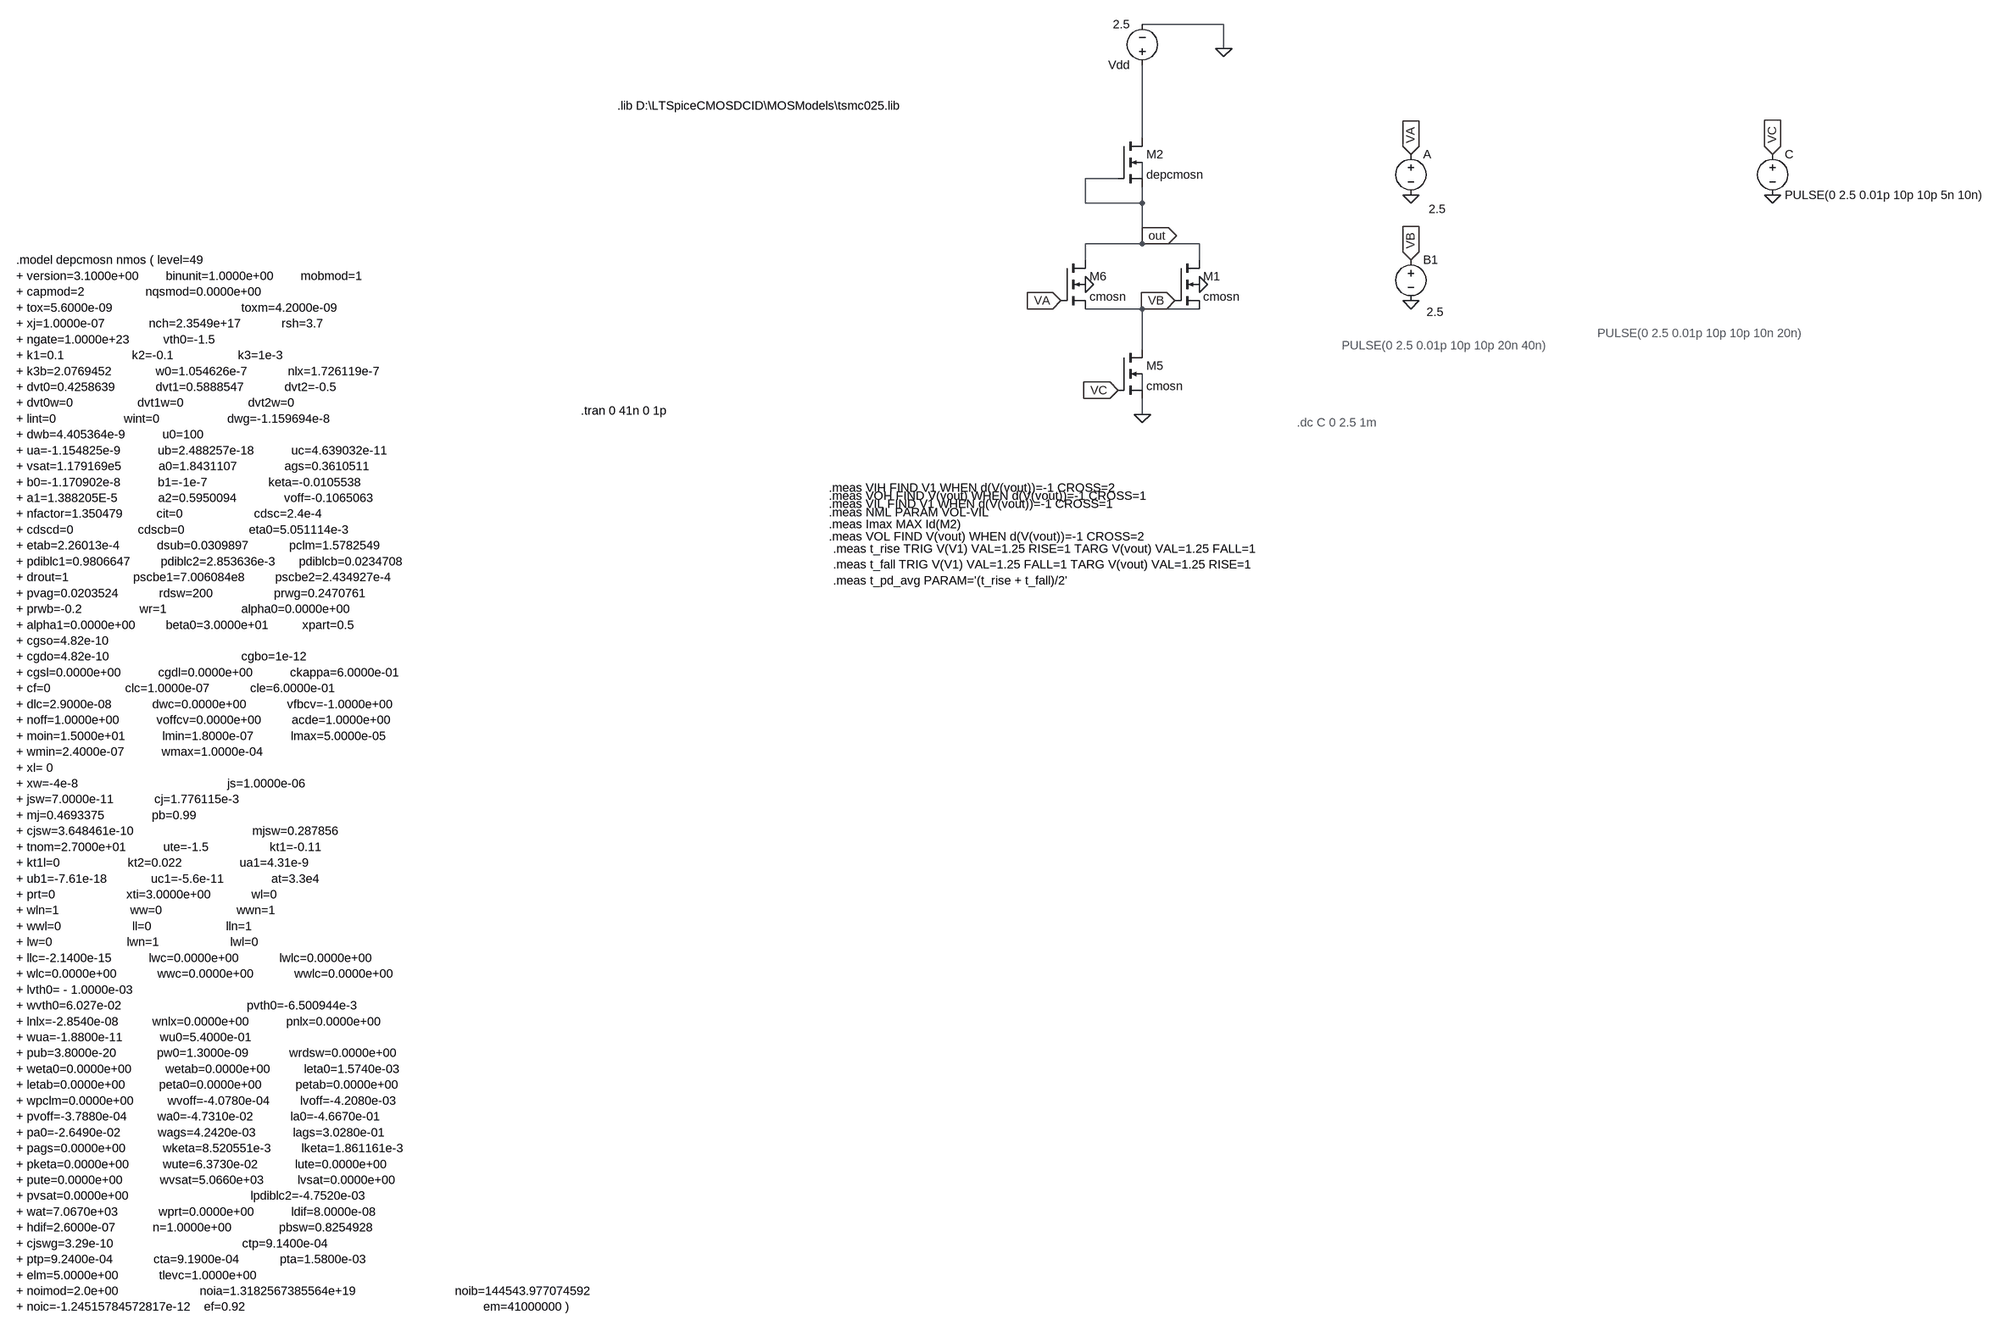
[diagram p0: schematic dep.asc]
dep.asc, the LTspice schematic file:
Version 4
SHEET 1 2744 1816
WIRE 1184 -512 1024 -512
WIRE 1184 -464 1184 -512
WIRE 1024 -288 1024 -432
WIRE 976 -208 912 -208
WIRE 1024 -208 1024 -240
WIRE 912 -160 912 -208
WIRE 1024 -160 1024 -192
WIRE 1024 -160 912 -160
WIRE 1024 -96 1024 -160
WIRE 1024 -80 1024 -96
WIRE 1024 -80 912 -80
WIRE 1136 -80 1024 -80
WIRE 912 -48 912 -80
WIRE 1136 -48 1136 -80
WIRE 1024 48 912 48
WIRE 1136 48 1024 48
WIRE 1024 128 1024 48
WIRE 1024 208 1024 176
WIRE 1024 256 1024 224
FLAG 1024 256 0
FLAG 1184 -464 0
FLAG 912 0 0
FLAG 1136 0 0
FLAG 1552 -256 VA
IOPIN 1552 -256 In
FLAG 2288 -256 VC
IOPIN 2288 -256 In
FLAG 1552 -176 0
FLAG 2288 -176 0
FLAG 864 32 VA
IOPIN 864 32 In
FLAG 1088 32 VB
IOPIN 1088 32 In
FLAG 976 208 VC
IOPIN 976 208 In
FLAG 1024 -96 out
IOPIN 1024 -96 Out
FLAG 1552 -48 VB
IOPIN 1552 -48 In
FLAG 1552 32 0
SYMBOL nmos4 1088 -48 R0
SYMATTR InstName M1
SYMATTR Value cmosn
SYMATTR Value2 l=250n w=360n ad=0.1728p as=0.1728p pd=1680n ps=1680n
SYMBOL voltage 1024 -416 R180
WINDOW 123 0 0 Left 0
WINDOW 39 0 0 Left 0
SYMATTR InstName Vdd
SYMATTR Value 2.5
SYMBOL nmos4 976 128 R0
SYMATTR InstName M5
SYMATTR Value cmosn
SYMATTR Value2 l=250n w=360n ad=0.1728p as=0.1728p pd=1680n ps=1680n
SYMBOL nmos4 864 -48 R0
SYMATTR InstName M6
SYMATTR Value cmosn
SYMATTR Value2 l=250n w=360n ad=0.1728p as=0.1728p pd=1680n ps=1680n
SYMBOL voltage 1552 -272 R0
WINDOW 3 35 124 Left 2
WINDOW 123 0 0 Left 0
WINDOW 39 0 0 Left 0
SYMATTR InstName A
SYMATTR Value 2.5
SYMBOL voltage 2288 -272 R0
SYMATTR InstName C
SYMATTR Value PULSE(0 2.5 0.01p 10p 10p 5n 10n)
SYMBOL voltage 1552 -64 R0
WINDOW 3 31 118 Left 2
SYMATTR InstName B1
SYMATTR Value 2.5
SYMBOL cmosn 976 -288 R0
SYMATTR InstName M2
SYMATTR Value depcmosn
TEXT -8 -352 Left 2 !.lib D:\\LTSpiceCMOSDCID\\MOSModels\\tsmc025.lib
TEXT 408 496 Left 2 !.meas VOL FIND V(vout) WHEN d(V(vout))=-1 CROSS=2
TEXT 408 400 Left 2 !.meas VIH FIND V1 WHEN d(V(vout))=-1 CROSS=2
TEXT 408 416 Left 2 !.meas VOH FIND V(vout) WHEN d(V(vout))=-1 CROSS=1
TEXT 408 432 Left 2 !.meas VIL FIND V1 WHEN d(V(vout))=-1 CROSS=1
TEXT 408 448 Left 2 !.meas NML PARAM VOL-VIL
TEXT 408 472 Left 2 !.meas Imax MAX Id(M2)
TEXT 416 520 Left 2 !.meas t_rise TRIG V(V1) VAL=1.25 RISE=1 TARG V(vout) VAL=1.25 FALL=1\n.meas t_fall TRIG V(V1) VAL=1.25 FALL=1 TARG V(vout) VAL=1.25 RISE=1\n.meas t_pd_avg PARAM='(t_rise + t_fall)/2'
TEXT -80 248 Left 2 !.tran 0 41n 0 1p
TEXT 1328 272 Left 2 ;.dc C 0 2.5 1m
TEXT 1416 120 Left 2 ;PULSE(0 2.5 0.01p 10p 10p 20n 40n)
TEXT 1944 96 Left 2 ;PULSE(0 2.5 0.01p 10p 10p 10n 20n)
TEXT -1208 -48 Left 2 !.model depcmosn nmos ( level=49\n+ version=3.1000e+00        binunit=1.0000e+00        mobmod=1\n+ capmod=2                  nqsmod=0.0000e+00         \n+ tox=5.6000e-09                                      toxm=4.2000e-09\n+ xj=1.0000e-07             nch=2.3549e+17            rsh=3.7\n+ ngate=1.0000e+23          vth0=-1.5\n+ k1=0.1                    k2=-0.1                   k3=1e-3\n+ k3b=2.0769452             w0=1.054626e-7            nlx=1.726119e-7\n+ dvt0=0.4258639            dvt1=0.5888547            dvt2=-0.5\n+ dvt0w=0                   dvt1w=0                   dvt2w=0\n+ lint=0                    wint=0                    dwg=-1.159694e-8\n+ dwb=4.405364e-9           u0=100\n+ ua=-1.154825e-9           ub=2.488257e-18           uc=4.639032e-11\n+ vsat=1.179169e5           a0=1.8431107              ags=0.3610511\n+ b0=-1.170902e-8           b1=-1e-7                  keta=-0.0105538\n+ a1=1.388205E-5            a2=0.5950094              voff=-0.1065063\n+ nfactor=1.350479          cit=0                     cdsc=2.4e-4\n+ cdscd=0                   cdscb=0                   eta0=5.051114e-3\n+ etab=2.26013e-4           dsub=0.0309897            pclm=1.5782549\n+ pdiblc1=0.9806647         pdiblc2=2.853636e-3       pdiblcb=0.0234708\n+ drout=1                   pscbe1=7.006084e8         pscbe2=2.434927e-4\n+ pvag=0.0203524            rdsw=200                  prwg=0.2470761\n+ prwb=-0.2                 wr=1                      alpha0=0.0000e+00\n+ alpha1=0.0000e+00         beta0=3.0000e+01          xpart=0.5\n+ cgso=4.82e-10                     \n+ cgdo=4.82e-10                                       cgbo=1e-12\n+ cgsl=0.0000e+00           cgdl=0.0000e+00           ckappa=6.0000e-01\n+ cf=0                      clc=1.0000e-07            cle=6.0000e-01\n+ dlc=2.9000e-08            dwc=0.0000e+00            vfbcv=-1.0000e+00\n+ noff=1.0000e+00           voffcv=0.0000e+00         acde=1.0000e+00\n+ moin=1.5000e+01           lmin=1.8000e-07           lmax=5.0000e-05\n+ wmin=2.4000e-07           wmax=1.0000e-04           \n+ xl= 0                      \n+ xw=-4e-8                                            js=1.0000e-06\n+ jsw=7.0000e-11            cj=1.776115e-3 \n+ mj=0.4693375              pb=0.99             \n+ cjsw=3.648461e-10                                   mjsw=0.287856\n+ tnom=2.7000e+01           ute=-1.5                  kt1=-0.11\n+ kt1l=0                    kt2=0.022                 ua1=4.31e-9\n+ ub1=-7.61e-18             uc1=-5.6e-11              at=3.3e4\n+ prt=0                     xti=3.0000e+00            wl=0\n+ wln=1                     ww=0                      wwn=1\n+ wwl=0                     ll=0                      lln=1\n+ lw=0                      lwn=1                     lwl=0\n+ llc=-2.1400e-15           lwc=0.0000e+00            lwlc=0.0000e+00\n+ wlc=0.0000e+00            wwc=0.0000e+00            wwlc=0.0000e+00\n+ lvth0= - 1.0000e-03                \n+ wvth0=6.027e-02                                     pvth0=-6.500944e-3\n+ lnlx=-2.8540e-08          wnlx=0.0000e+00           pnlx=0.0000e+00\n+ wua=-1.8800e-11           wu0=5.4000e-01\n+ pub=3.8000e-20            pw0=1.3000e-09            wrdsw=0.0000e+00\n+ weta0=0.0000e+00          wetab=0.0000e+00          leta0=1.5740e-03\n+ letab=0.0000e+00          peta0=0.0000e+00          petab=0.0000e+00\n+ wpclm=0.0000e+00          wvoff=-4.0780e-04         lvoff=-4.2080e-03\n+ pvoff=-3.7880e-04         wa0=-4.7310e-02           la0=-4.6670e-01\n+ pa0=-2.6490e-02           wags=4.2420e-03           lags=3.0280e-01\n+ pags=0.0000e+00           wketa=8.520551e-3         lketa=1.861161e-3\n+ pketa=0.0000e+00          wute=6.3730e-02           lute=0.0000e+00\n+ pute=0.0000e+00           wvsat=5.0660e+03          lvsat=0.0000e+00\n+ pvsat=0.0000e+00                                    lpdiblc2=-4.7520e-03\n+ wat=7.0670e+03            wprt=0.0000e+00           ldif=8.0000e-08\n+ hdif=2.6000e-07           n=1.0000e+00              pbsw=0.8254928\n+ cjswg=3.29e-10                                      ctp=9.1400e-04\n+ ptp=9.2400e-04            cta=9.1900e-04            pta=1.5800e-03\n+ elm=5.0000e+00            tlevc=1.0000e+00          \n+ noimod=2.0e+00                        noia=1.3182567385564e+19                                noib=144543.977074592\n+ noic=-1.24515784572817e-12    ef=0.92                                                                         em=41000000 )

The netlist it stands for:
* dep.asc
M1 out VB N003 0 cmosn l=250n w=360n ad=0.1728p as=0.1728p pd=1680n ps=1680n
Vdd N001 0 2.5
M5 N003 VC 0 N004 cmosn l=250n w=360n ad=0.1728p as=0.1728p pd=1680n ps=1680n
M6 out VA N003 0 cmosn l=250n w=360n ad=0.1728p as=0.1728p pd=1680n ps=1680n
V§A VA 0 2.5
V§C VC 0 PULSE(0 2.5 0.01p 10p 10p 5n 10n)
V§B1 VB 0 2.5
M2 N001 out out N002 depcmosn
.model NMOS NMOS
.model PMOS PMOS
.lib standard.mos
.lib D:\LTSpiceCMOSDCID\MOSModels\tsmc025.lib
.meas VOL FIND V(vout) WHEN d(V(vout))=-1 CROSS=2
.meas VIH FIND V1 WHEN d(V(vout))=-1 CROSS=2
.meas VOH FIND V(vout) WHEN d(V(vout))=-1 CROSS=1
.meas VIL FIND V1 WHEN d(V(vout))=-1 CROSS=1
.meas NML PARAM VOL-VIL
.meas Imax MAX Id(M2)
.meas t_rise TRIG V(V1) VAL=1.25 RISE=1 TARG V(vout) VAL=1.25 FALL=1
.meas t_fall TRIG V(V1) VAL=1.25 FALL=1 TARG V(vout) VAL=1.25 RISE=1
.meas t_pd_avg PARAM='(t_rise + t_fall)/2'
.tran 0 41n 0 1p
* .dc C 0 2.5 1m
* PULSE(0 2.5 0.01p 10p 10p 20n 40n)
* PULSE(0 2.5 0.01p 10p 10p 10n 20n)
.model depcmosn nmos ( level=49
+ version=3.1000e+00        binunit=1.0000e+00        mobmod=1
+ capmod=2                  nqsmod=0.0000e+00
+ tox=5.6000e-09                                      toxm=4.2000e-09
+ xj=1.0000e-07             nch=2.3549e+17            rsh=3.7
+ ngate=1.0000e+23          vth0=-1.5
+ k1=0.1                    k2=-0.1                   k3=1e-3
+ k3b=2.0769452             w0=1.054626e-7            nlx=1.726119e-7
+ dvt0=0.4258639            dvt1=0.5888547            dvt2=-0.5
+ dvt0w=0                   dvt1w=0                   dvt2w=0
+ lint=0                    wint=0                    dwg=-1.159694e-8
+ dwb=4.405364e-9           u0=100
+ ua=-1.154825e-9           ub=2.488257e-18           uc=4.639032e-11
+ vsat=1.179169e5           a0=1.8431107              ags=0.3610511
+ b0=-1.170902e-8           b1=-1e-7                  keta=-0.0105538
+ a1=1.388205E-5            a2=0.5950094              voff=-0.1065063
+ nfactor=1.350479          cit=0                     cdsc=2.4e-4
+ cdscd=0                   cdscb=0                   eta0=5.051114e-3
+ etab=2.26013e-4           dsub=0.0309897            pclm=1.5782549
+ pdiblc1=0.9806647         pdiblc2=2.853636e-3       pdiblcb=0.0234708
+ drout=1                   pscbe1=7.006084e8         pscbe2=2.434927e-4
+ pvag=0.0203524            rdsw=200                  prwg=0.2470761
+ prwb=-0.2                 wr=1                      alpha0=0.0000e+00
+ alpha1=0.0000e+00         beta0=3.0000e+01          xpart=0.5
+ cgso=4.82e-10
+ cgdo=4.82e-10                                       cgbo=1e-12
+ cgsl=0.0000e+00           cgdl=0.0000e+00           ckappa=6.0000e-01
+ cf=0                      clc=1.0000e-07            cle=6.0000e-01
+ dlc=2.9000e-08            dwc=0.0000e+00            vfbcv=-1.0000e+00
+ noff=1.0000e+00           voffcv=0.0000e+00         acde=1.0000e+00
+ moin=1.5000e+01           lmin=1.8000e-07           lmax=5.0000e-05
+ wmin=2.4000e-07           wmax=1.0000e-04
+ xl= 0
+ xw=-4e-8                                            js=1.0000e-06
+ jsw=7.0000e-11            cj=1.776115e-3
+ mj=0.4693375              pb=0.99
+ cjsw=3.648461e-10                                   mjsw=0.287856
+ tnom=2.7000e+01           ute=-1.5                  kt1=-0.11
+ kt1l=0                    kt2=0.022                 ua1=4.31e-9
+ ub1=-7.61e-18             uc1=-5.6e-11              at=3.3e4
+ prt=0                     xti=3.0000e+00            wl=0
+ wln=1                     ww=0                      wwn=1
+ wwl=0                     ll=0                      lln=1
+ lw=0                      lwn=1                     lwl=0
+ llc=-2.1400e-15           lwc=0.0000e+00            lwlc=0.0000e+00
+ wlc=0.0000e+00            wwc=0.0000e+00            wwlc=0.0000e+00
+ lvth0= - 1.0000e-03
+ wvth0=6.027e-02                                     pvth0=-6.500944e-3
+ lnlx=-2.8540e-08          wnlx=0.0000e+00           pnlx=0.0000e+00
+ wua=-1.8800e-11           wu0=5.4000e-01
+ pub=3.8000e-20            pw0=1.3000e-09            wrdsw=0.0000e+00
+ weta0=0.0000e+00          wetab=0.0000e+00          leta0=1.5740e-03
+ letab=0.0000e+00          peta0=0.0000e+00          petab=0.0000e+00
+ wpclm=0.0000e+00          wvoff=-4.0780e-04         lvoff=-4.2080e-03
+ pvoff=-3.7880e-04         wa0=-4.7310e-02           la0=-4.6670e-01
+ pa0=-2.6490e-02           wags=4.2420e-03           lags=3.0280e-01
+ pags=0.0000e+00           wketa=8.520551e-3         lketa=1.861161e-3
+ pketa=0.0000e+00          wute=6.3730e-02           lute=0.0000e+00
+ pute=0.0000e+00           wvsat=5.0660e+03          lvsat=0.0000e+00
+ pvsat=0.0000e+00                                    lpdiblc2=-4.7520e-03
+ wat=7.0670e+03            wprt=0.0000e+00           ldif=8.0000e-08
+ hdif=2.6000e-07           n=1.0000e+00              pbsw=0.8254928
+ cjswg=3.29e-10                                      ctp=9.1400e-04
+ ptp=9.2400e-04            cta=9.1900e-04            pta=1.5800e-03
+ elm=5.0000e+00            tlevc=1.0000e+00
+ noimod=2.0e+00                        noia=1.3182567385564e+19                                noib=144543.977074592
+ noic=-1.24515784572817e-12    ef=0.92                                                                         em=41000000 )
.backanno
.end

* Results of the author's LTspice run, read from the files saved beside the schematic
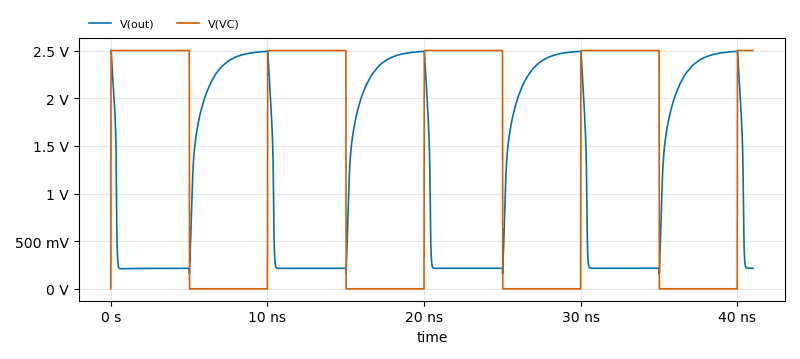
[diagram p1: Transient Analysis of dep.asc, plotted from the saved traces]
* Transient Analysis, 1 run:
*   V(out): min 155.7 mV, max 2.502 V, average 1.268 V, rms 1.633 V, last 215.8 mV
*   V(VC): min 0 V, max 2.5 V, average 1.283 V, rms 1.79 V, last 2.5 V
* From the log:
*   Measurement "vol" FAIL'ed
*   Measurement "vih" FAIL'ed
*   Measurement "voh" FAIL'ed
*   Measurement "vil" FAIL'ed
*   Measurement "nml" FAIL'ed
*   imax: MAX(id(m2))=0.00017041 FROM 0 TO 4.1e-08
*   Measurement "t_rise" FAIL'ed
*   Measurement "t_fall" FAIL'ed
*   Measurement "t_pd_avg" FAIL'ed